# EAGLE design rk86_tft (EAGLE 7.7.0)

## Sheet 1 of 2
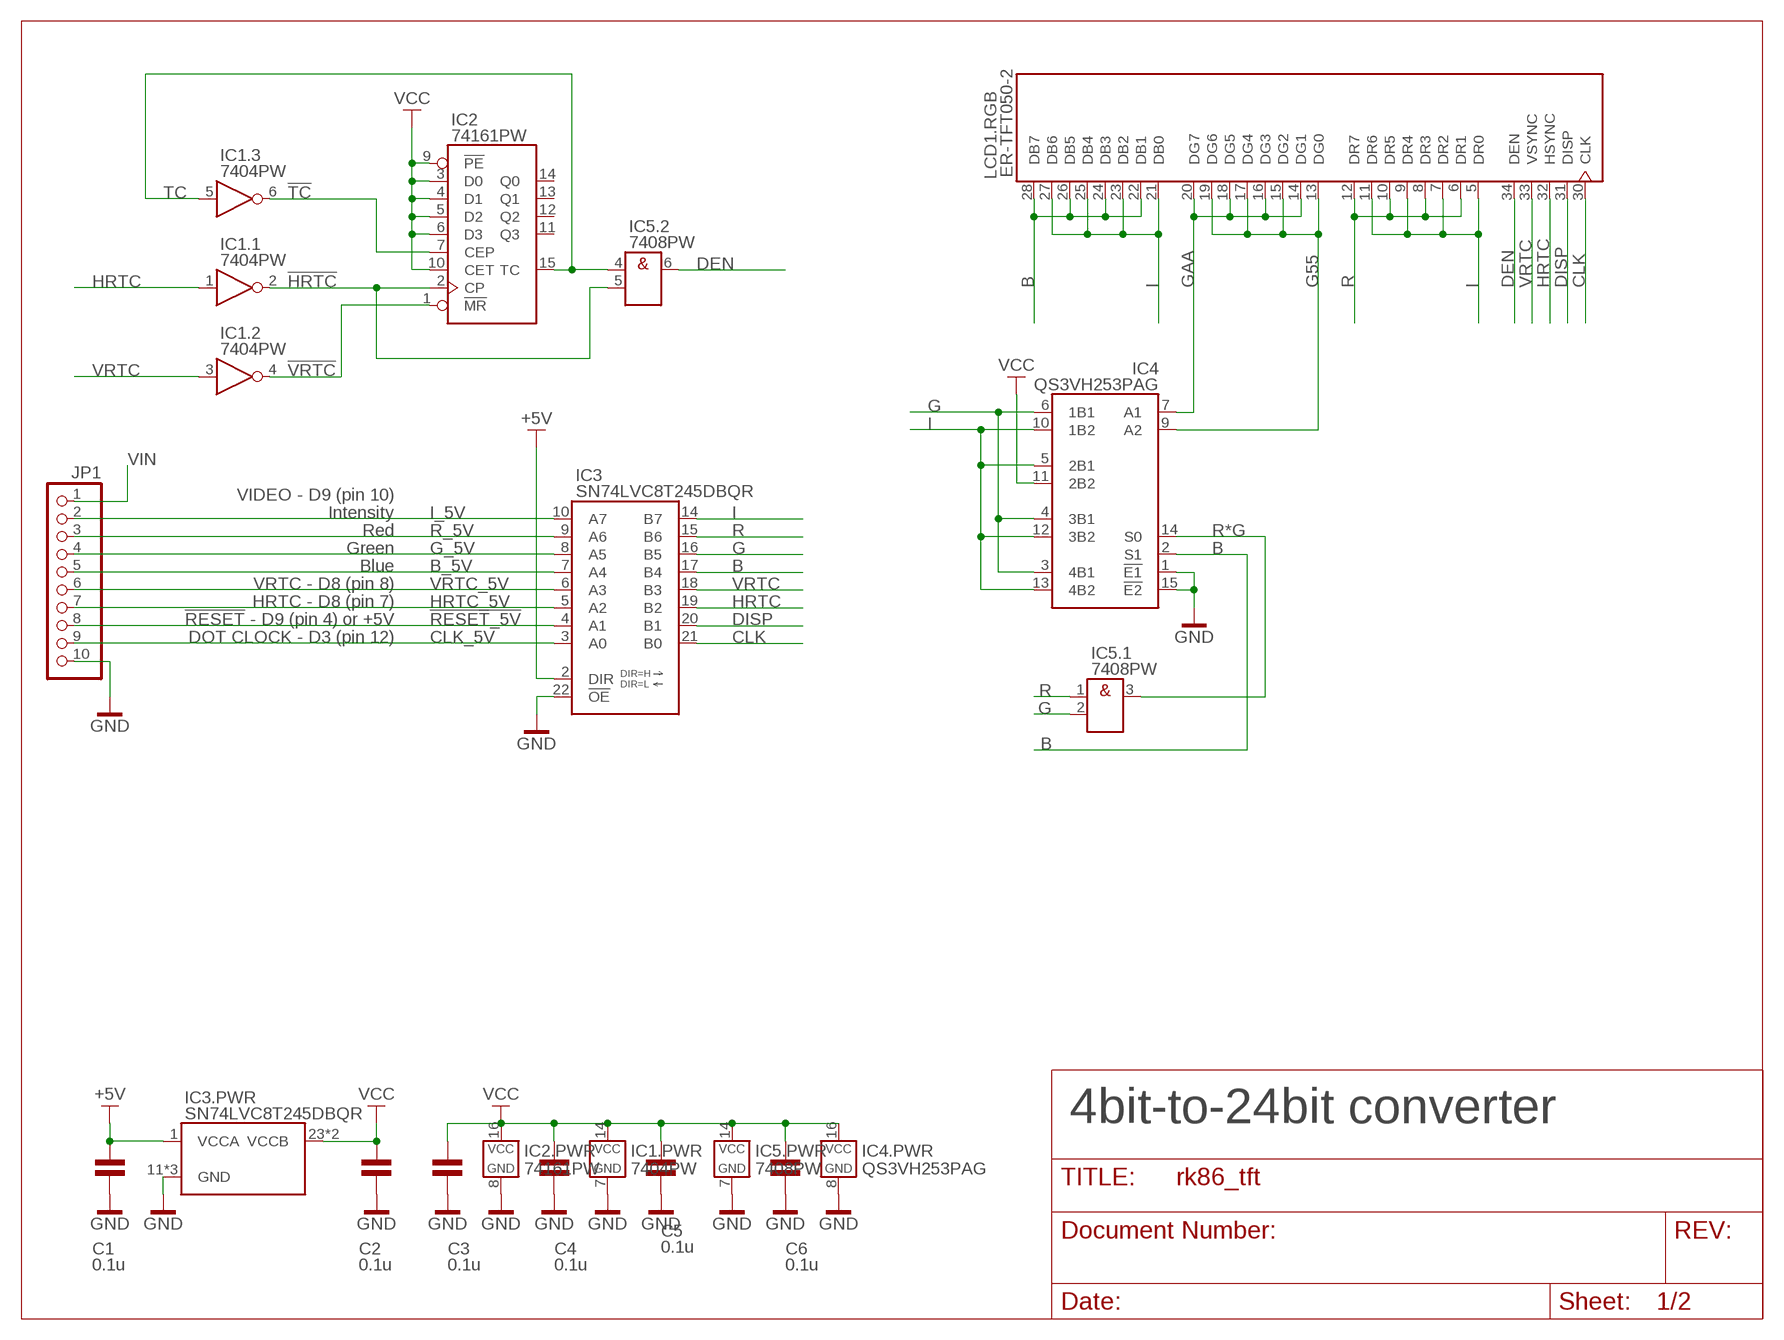
[diagram p0: schematic, sheet 1]

### Parts
C1  0.1u  CAPACITOR_SMD0805  [0805]
C2  0.1u  CAPACITOR_SMD0805  [0805]
C3  0.1u  CAPACITOR_SMD0805  [0805]
C4  0.1u  CAPACITOR_SMD0805  [0805]
C5  0.1u  CAPACITOR_SMD0805  [0805]
C6  0.1u  CAPACITOR_SMD0805  [0805]
IC1  7404PW  [TSSOP14_4.4]
IC2  74161PW  [TSSOP16_4.4]
IC3  SN74LVC8T245DBQR  [TI_DBQ24]
IC4  QS3VH253PAG  [TSSOP16_4.4]
IC5  7408PW  [TSSOP14_4.4]
JP1  PINHD-1X10/90  [1X10/90]
LCD1  ER-TFT050-2  [MOLEX_54104-4031]

### Nets
!HRTC: IC1.2(.1:Y) IC2.2(CP) IC5.5(.2:B) ; also sheet 2
!RESET_5V: IC3.4(A1) JP1.8
!TC: IC1.6(.3:Y) IC2.7(CEP)
!VRTC: IC1.4(.2:Y) IC2.1(!MR) ; also sheet 2
+5V [power]: C1.2 IC3.1(VCCA) IC3.2(DIR) ; also sheet 2
B: IC3.17(B4) IC4.2(S1) LCD1.22(.RGB:DB1) LCD1.24(.RGB:DB3) LCD1.26(.RGB:DB5) LCD1.28(.RGB:DB7)
B_5V: IC3.7(A4) JP1.5
CLK: IC3.21(B0) LCD1.30(.RGB:CLK) ; also sheet 2
CLK_5V: IC3.3(A0) JP1.9
DEN: IC5.6(.2:Y) LCD1.34(.RGB:DEN) ; also sheet 2
DISP: IC3.20(B1) LCD1.31(.RGB:DISP)
G: IC3.16(B5) IC4.3(4B1) IC4.4(3B1) IC4.6(1B1) IC5.2(.1:B)
G55: IC4.9(A2) LCD1.13(.RGB:DG0) LCD1.15(.RGB:DG2) LCD1.17(.RGB:DG4) LCD1.19(.RGB:DG6)
G_5V: IC3.8(A5) JP1.4
GAA: IC4.7(A1) LCD1.14(.RGB:DG1) LCD1.16(.RGB:DG3) LCD1.18(.RGB:DG5) LCD1.20(.RGB:DG7)
GND [power]: C1.1 C2.1 C3.1 C4.1 C5.1 C6.1 IC1.7(.PWR:GND) IC2.8(GND) IC3.11(GND) IC3.12(GND) IC3.13(GND) IC3.22(!OE) IC4.1(!E1) IC4.8(GND) IC4.15(!E2) IC5.7(.PWR:GND) JP1.10 ; also sheet 2
HRTC: IC1.1(.1:A) IC3.19(B2) LCD1.32(.RGB:HSYNC)
HRTC_5V: IC3.5(A2) JP1.7
I: IC3.14(B7) IC4.5(2B1) IC4.10(1B2) IC4.12(3B2) IC4.13(4B2) LCD1.5(.RGB:DR0) LCD1.7(.RGB:DR2) LCD1.9(.RGB:DR4) LCD1.11(.RGB:DR6) LCD1.21(.RGB:DB0) LCD1.23(.RGB:DB2) LCD1.25(.RGB:DB4) LCD1.27(.RGB:DB6)
I_5V: IC3.10(A7) JP1.2
R: IC3.15(B6) IC5.1(.1:A) LCD1.6(.RGB:DR1) LCD1.8(.RGB:DR3) LCD1.10(.RGB:DR5) LCD1.12(.RGB:DR7)
R*G: IC4.14(S0) IC5.3(.1:Y)
R_5V: IC3.9(A6) JP1.3
TC: IC1.5(.3:A) IC2.15(TC) IC5.4(.2:A)
VCC [power]: C2.2 C3.2 C4.2 C5.2 C6.2 IC1.14(.PWR:VCC) IC2.3(D0) IC2.4(D1) IC2.5(D2) IC2.6(D3) IC2.9(!PE) IC2.10(CET) IC2.16(VCC) IC3.23(VCCB) IC3.24(VCCB) IC4.11(2B2) IC4.16(VCC) IC5.14(.PWR:VCC) ; also sheet 2
VIN [power]: JP1.1 ; also sheet 2
VRTC: IC1.3(.2:A) IC3.18(B3) LCD1.33(.RGB:VSYNC)
VRTC_5V: IC3.6(A3) JP1.6
Unconnected: IC2.11(Q3) IC2.12(Q2) IC2.13(Q1) IC2.14(Q0)

### Notes on the sheet
- VIDEO - D9 (pin 10)
- Intensity
- Red
- Green
- Blue
- VRTC - D8 (pin 8)
- HRTC - D8 (pin 7)
- !RESET! - D9 (pin 4) or +5V
- DOT CLOCK - D3 (pin 12)
- 4bit-to-24bit converter

## Sheet 2 of 2
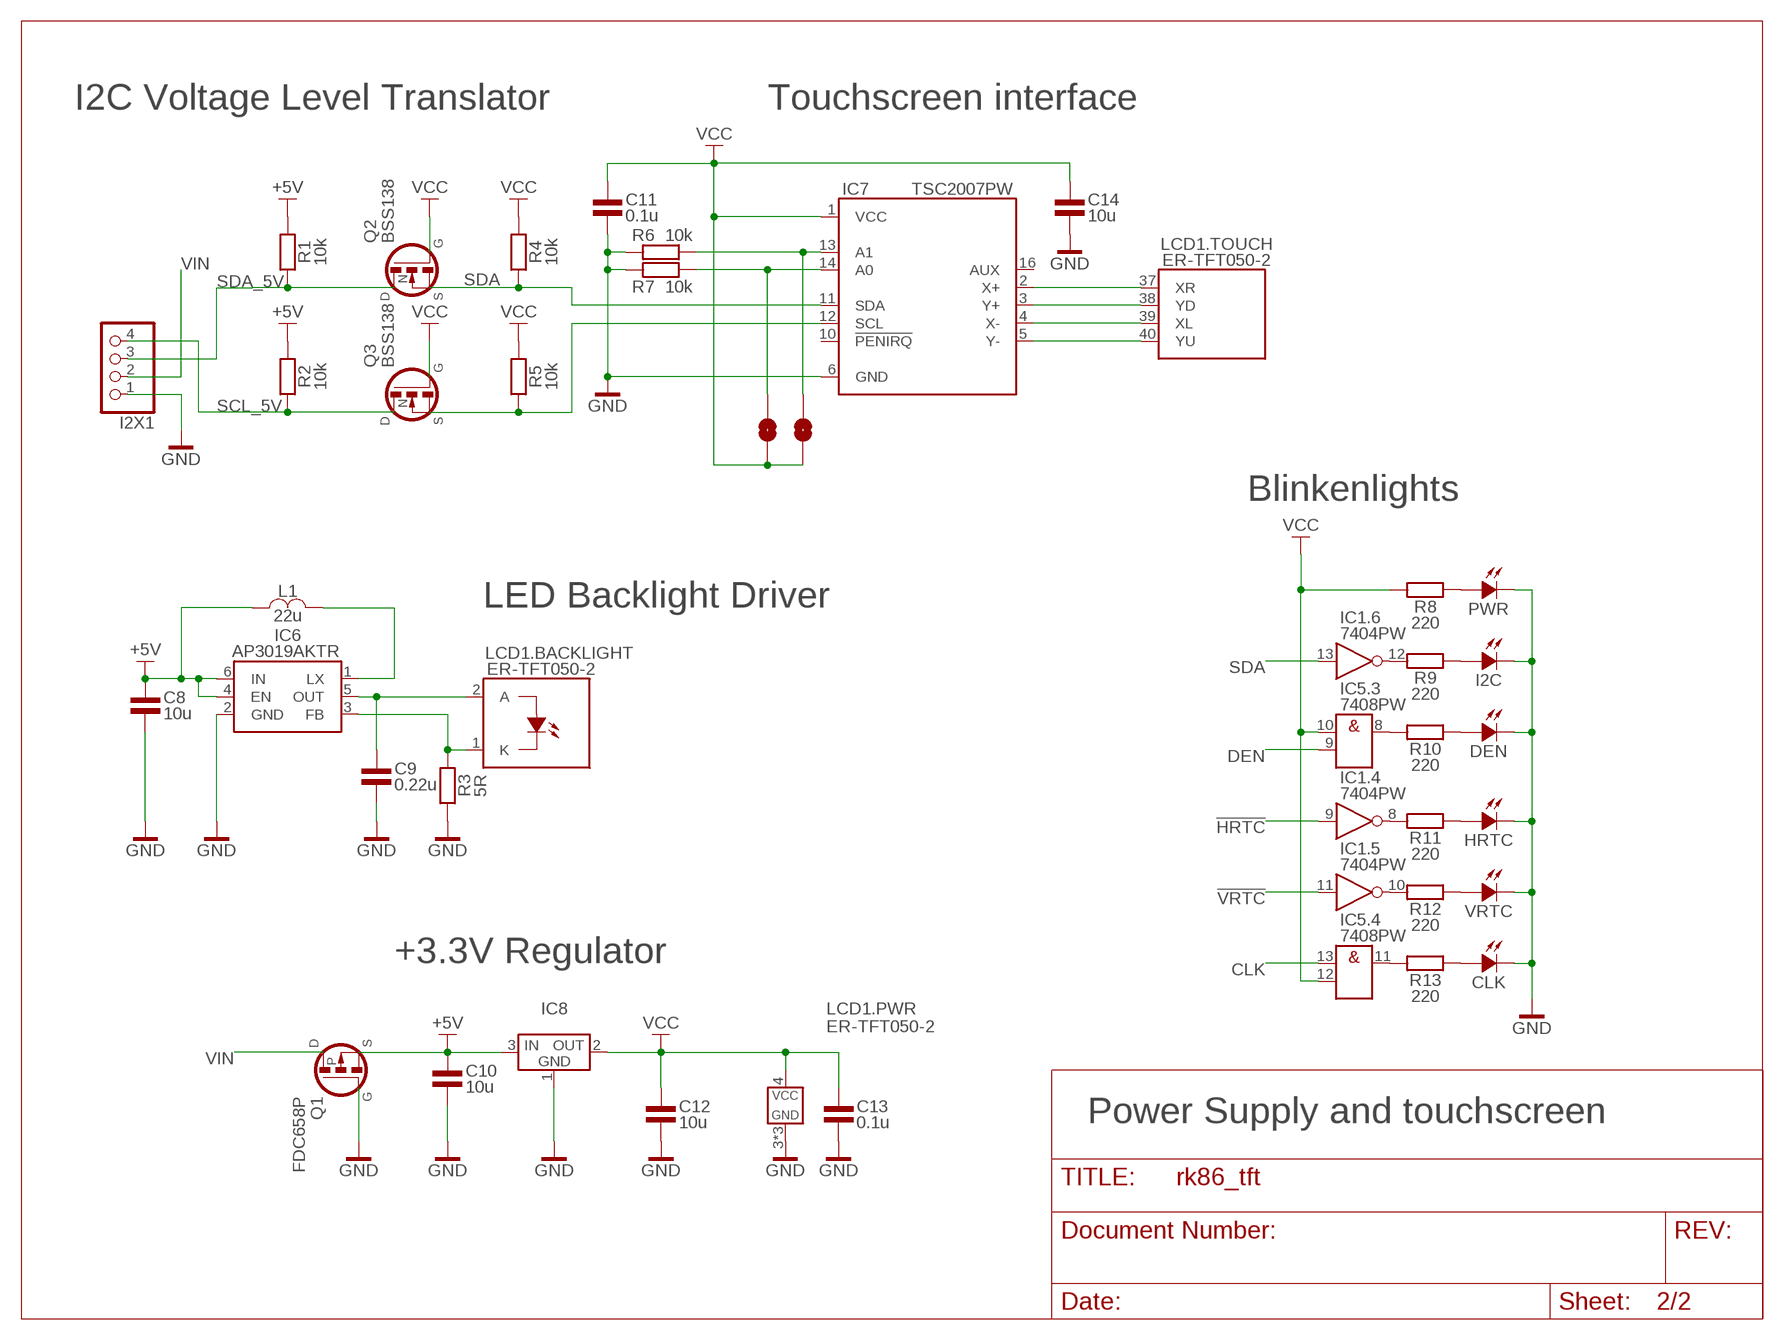
[diagram p1: schematic, sheet 2]

### Parts
A0  SJ  [SJ]
A1  SJ  [SJ]
C8  10u  CAPACITOR_SMD0805  [0805]
C9  0.22u  CAPACITOR_SMD0805  [0805]
C10  10u  CAPACITOR_SMD0805  [0805]
C11  0.1u  CAPACITOR_SMD0805  [0805]
C12  10u  CAPACITOR_SMD0805  [0805]
C13  0.1u  CAPACITOR_SMD0805  [0805]
C14  10u  CAPACITOR_SMD0805  [0805]
CLK  LED0805  [0805POL]
DEN  LED0805  [0805POL]
HRTC  LED0805  [0805POL]
I2C  LED0805  [0805POL]
I2X1  PINHD-1X4/90  [1X04/90]
IC6  AP3019AKTR  [SOT23-6]
IC7  TSC2007PW  [TSSOP16_4.4]
IC8  MCP1700TT  [SOT23-3]
L1  22u  INDUCTOR_FIXEDXTL7030  [COILCRAFT_XTL7030]
PWR  LED0805  [0805POL]
Q1  FDC658P  [SOT23-6]
Q2  BSS138  [SOT23-3]
Q3  BSS138  [SOT23-3]
R1  10k  RESISTOR0805  [0805]
R2  10k  RESISTOR0805  [0805]
R3  5R  RESISTOR0805  [0805]
R4  10k  RESISTOR0805  [0805]
R5  10k  RESISTOR0805  [0805]
R6  10k  RESISTOR0805  [0805]
R7  10k  RESISTOR0805  [0805]
R8  220  RESISTOR0805  [0805]
R9  220  RESISTOR0805  [0805]
R10  220  RESISTOR0805  [0805]
R11  220  RESISTOR0805  [0805]
R12  220  RESISTOR0805  [0805]
R13  220  RESISTOR0805  [0805]
VRTC  LED0805  [0805POL]

### Nets
!HRTC: IC1.9(.4:A) ; also sheet 1
!VRTC: IC1.11(.5:A) ; also sheet 1
+5V [power]: C8.2 C10.2 IC6.4(EN) IC6.6(IN) IC8.3(IN) L1.1 Q1.4(S) R1.2 R2.2 ; also sheet 1
CLK: IC5.13(.4:A) ; also sheet 1
DEN: IC5.9(.3:B) ; also sheet 1
GND [power]: C8.1 C9.1 C10.1 C11.1 C12.1 C13.1 C14.1 CLK.K DEN.K HRTC.K I2C.K I2X1.1 IC6.2(GND) IC7.6(GND) IC8.1(GND) LCD1.3(.PWR:GND) LCD1.29(.PWR:GND) LCD1.36(.PWR:GND) PWR.K Q1.3(G) R3.1 R6.1 R7.1 VRTC.K ; also sheet 1
LEDA [power]: C9.2 IC6.5(OUT) LCD1.2(.BACKLIGHT:A)
LEDK [power]: IC6.3(FB) LCD1.1(.BACKLIGHT:K) R3.2
LX [power]: IC6.1(LX) L1.2
N$1: IC1.8(.4:Y) R11.1
N$2: IC1.10(.5:Y) R12.1
N$3: IC1.12(.6:Y) R9.1
N$4: IC5.11(.4:Y) R13.1
N$5: IC5.8(.3:Y) R10.1
N$6: A1.2 IC7.13(A1) R6.2
N$7: A0.2 IC7.14(A0) R7.2
N$71: I2C.A R9.2
N$72: DEN.A R10.2
N$73: HRTC.A R11.2
N$74: R12.2 VRTC.A
N$77: IC7.2(X+) LCD1.37(.TOUCH:XR)
N$78: IC7.4(X-) LCD1.39(.TOUCH:XL)
N$79: IC7.3(Y+) LCD1.38(.TOUCH:YD)
N$80: IC7.5(Y-) LCD1.40(.TOUCH:YU)
N$90: CLK.A R13.2
N$91: PWR.A R8.2
SCL: IC7.12(SCL) Q3.2(S) R5.1
SCL_5V: I2X1.4 Q3.3(D) R2.1
SDA: IC1.13(.6:A) IC7.11(SDA) Q2.2(S) R4.1
SDA_5V: I2X1.3 Q2.3(D) R1.1
VCC [power]: A0.1 A1.1 C11.2 C12.2 C13.2 C14.2 IC5.10(.3:A) IC5.12(.4:B) IC7.1(VCC) IC8.2(OUT) LCD1.4(.PWR:VCC) Q2.1(G) Q3.1(G) R4.2 R5.2 R8.1 ; also sheet 1
VIN [power]: I2X1.2 Q1.1(D) Q1.2(D) Q1.5(D) Q1.6(D) ; also sheet 1
Unconnected: IC7.10(!PENIRQ) IC7.16(AUX)

### Notes on the sheet
- I2C Voltage Level Translator | Touchscreen interface
- Blinkenlights
- LED Backlight Driver
- +3.3V Regulator
- Power Supply and touchscreen

## Library data of the parts
A0 A1 = 1_eagle_lib:SJ: SMD solder JUMPER
C1-C6 C8-C14 = 1_eagle_lib:CAPACITOR_SMD
CLK DEN HRTC I2C PWR VRTC = 1_eagle_lib:LED: LED
I2X1 = pinhead:PINHD-1X4: PIN HEADER
IC1 = 1_eagle_lib:74*04: SNx4LVC04A Hex Inverters
IC2 = 1_eagle_lib:74*161: Presettable synchronous 4-bit binary counter; asynchronous reset
IC3 = 1_eagle_lib:SN74LVC8T245: SN74LVC8T245 8-Bit Dual-Supply Bus Transceiver With Configurable Voltage Translation and 3-State Outputs
IC4 = 1_eagle_lib:QS3VH253: QUICKSWITCH® PRODUCTS IDTQS3VH253 2.5V / 3.3V DUAL 4:1 MUX/DEMUX HIGH BANDWIDTH BUS SWITCH
IC5 = 1_eagle_lib:74*08: Quad 2-input AND gate
IC6 = 1_eagle_lib:AP3019A: The AP3019A is an inductor-based DC/DC converter designed to drive up to eight white LEDs in series for backlight. Only one feedback resistor is needed to control the LED current and obtain required brightness.
IC7 = 1_eagle_lib:TSC2007: TSC2007 Resisitive Touch Screen Controller
IC8 = 1_eagle_lib:MCP1700: Low Quiescent Current LDO
JP1 = pinhead:PINHD-1X10: PIN HEADER
L1 = 1_eagle_lib:INDUCTOR_FIXED: Bourns SRR4018 Series - Shielded SMD Power Inductors
LCD1 = 1_eagle_lib:ER-TFT050-2: ER-TFT050-2 5inch TFT display with RGB interface
Q1 = 1_eagle_lib:FDC658P: FDC658P Single P-Channel, Logic Level, PowerTrenchTM MOSFET
Q2 Q3 = 1_eagle_lib:BSS138: N-Channel Logic Level Enhancement Mode Field Effect Transistor
R1-R13 = 1_eagle_lib:RESISTOR: Vishay CMF Metal Film Resistors, Axial, Industrial, Precision

## Net classes
0 default: width 0.152 mm
1 power: width 0.254 mm

## Board
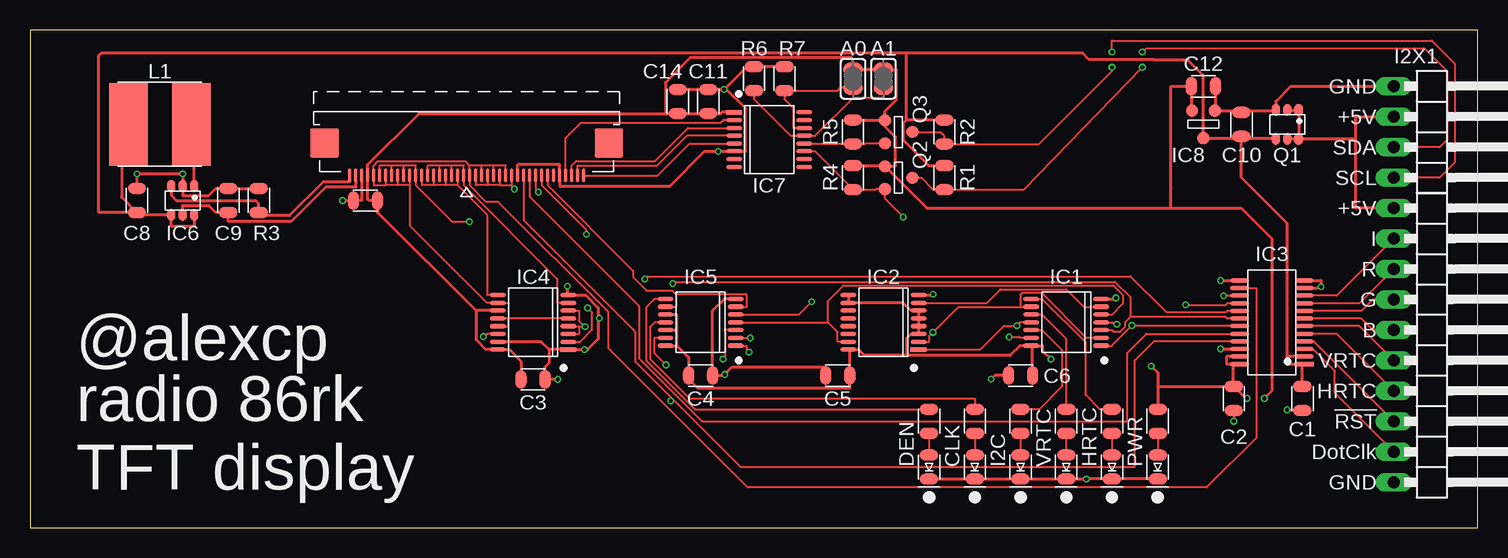
[diagram p2: board, top side]
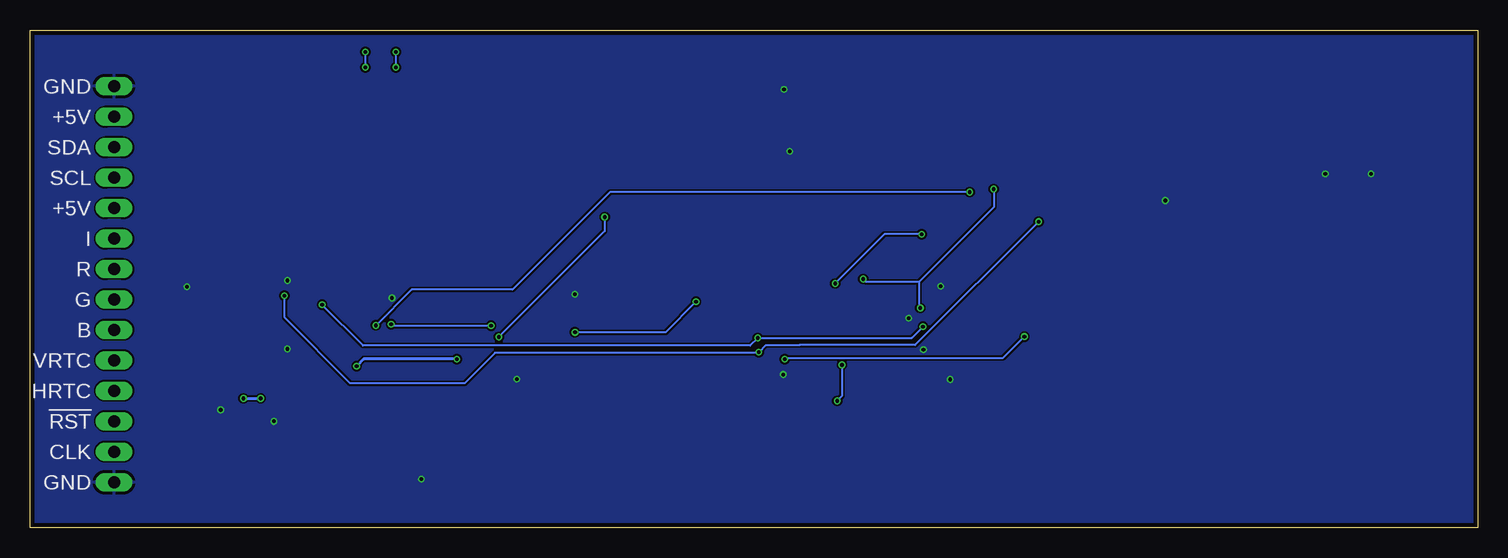
[diagram p3: board, bottom side, seen from below]

Size 120.7 x 41.53 mm. Coordinates in mm from the lower left corner, seen from the top.
Outline: 0,0 120.7,0 120.7,41.53 0,41.53 0,0
Copper layers (1*16): Top 0.035559375mm / dielectric 1.6mm / Bottom 0.035559375mm
Design rules "oshpark-2layer-tented": minimum track width 6mil, minimum drill 10mil, track to track 6mil, track to pad 6mil, pad to pad 6mil, via to via 6mil, smd to smd 6mil, copper to edge 15mil, drill to drill 6mil, minimum pad ring 5mil, minimum via ring 5mil, stop-mask expansion 2.5mil, vias tented up to drill 20mil, thermal gap 10mil

### Footprints (pad centres in the part's own frame; a part is rotated, then mirrored left to right if it is on the bottom)
SJ = smd 1.168 x 1.6: 1 -0.762,0; 2 0.762,0
0805 = smd 0.914 x 1.524: 1 -1.003,0; 2 1.003,0
0805POL = smd 0.914 x 1.524: A -1.003,0; K 1.003,0
1X04/90 = drill 1.016 long: 1 -3.81,-3.81; 2 -1.27,-3.81; 3 1.27,-3.81; 4 3.81,-3.81
TSSOP14_4.4 = smd 0.4 x 1.35: 1 -1.95,-2.925; 2 -1.3,-2.925; 3 -0.65,-2.925; 4 0,-2.925; 5 0.65,-2.925; 6 1.3,-2.925; 7 1.95,-2.925; 8 1.95,2.925; 9 1.3,2.925; 10 0.65,2.925; 11 0,2.925; 12 -0.65,2.925; 13 -1.3,2.925; 14 -1.95,2.925
TSSOP16_4.4 = smd 0.4 x 1.35: 1 -2.275,-2.925; 2 -1.625,-2.925; 3 -0.975,-2.925; 4 -0.325,-2.925; 5 0.325,-2.925; 6 0.975,-2.925; 7 1.625,-2.925; 8 2.275,-2.925; 9 2.275,2.925; 10 1.625,2.925; 11 0.975,2.925; 12 0.325,2.925; 13 -0.325,2.925; 14 -0.975,2.925; 15 -1.625,2.925; 16 -2.275,2.925
TI_DBQ24 = smd 0.4 x 1.6: 1 -3.493,-2.7; 2 -2.857,-2.7; 3 -2.223,-2.7; 4 -1.587,-2.7; 5 -0.953,-2.7; 6 -0.318,-2.7; 7 0.318,-2.7; 8 0.953,-2.7; 9 1.587,-2.7; 10 2.223,-2.7; 11 2.857,-2.7; 12 3.493,-2.7; 13 3.493,2.7; 14 2.857,2.7; 15 2.223,2.7; 16 1.587,2.7; 17 0.953,2.7; 18 0.318,2.7; 19 -0.318,2.7; 20 -0.953,2.7; 21 -1.587,2.7; 22 -2.223,2.7; 23 -2.857,2.7; 24 -3.493,2.7
SOT23-6 = smd 0.7 x 1: 1 -0.95,-1.2; 2 0,-1.2; 3 0.95,-1.2; 4 0.95,1.2; 5 0,1.2; 6 -0.95,1.2
SOT23-3 = smd 1.016 x 1.016: 1 -0.953,-1.143; 2 0.953,-1.143; 3 0,1.143
1X10/90 = drill 1.016 long: 1 -11.43,-3.81; 2 -8.89,-3.81; 3 -6.35,-3.81; 4 -3.81,-3.81; 5 -1.27,-3.81; 6 1.27,-3.81; 7 3.81,-3.81; 8 6.35,-3.81; 9 8.89,-3.81; 10 11.43,-3.81
COILCRAFT_XTL7030 = smd 3.2 x 6.85: 1 2.625,0; 2 -2.625,0
MOLEX_54104-4031 = smd 0.3 x 1.2: 1 9.75,0; 2 9.25,0; 3 8.75,0; 4 8.25,0; 5 7.75,0; 6 7.25,0; 7 6.75,0; 8 6.25,0; 9 5.75,0; 10 5.25,0; 11 4.75,0; 12 4.25,0; 13 3.75,0; 14 3.25,0; 15 2.75,0; 16 2.25,0; 17 1.75,0; 18 1.25,0; 19 0.75,0; 20 0.25,0; 21 -0.25,0; 22 -0.75,0; 23 -1.25,0; 24 -1.75,0; 25 -2.25,0; 26 -2.75,0; 27 -3.25,0; 28 -3.75,0; 29 -4.25,0; 30 -4.75,0; 31 -5.25,0; 32 -5.75,0; 33 -6.25,0; 34 -6.75,0; 35 -7.25,0; 36 -7.75,0; 37 -8.25,0; 38 -8.75,0; 39 -9.25,0; 40 -9.75,0 | smd 2.4 x 2.4: FIT1 11.85,-2.7; FIT2 -11.85,-2.7

### Placement (x,y rotation side)
A0  68.61,37.47 270 top
A1  71.15,37.47 270 top
C1  106.07,10.79 90 top
C2  100.36,10.79 90 top
C3  41.94,12.38 180 top
C4  55.91,12.7 180 top
C5  67.34,12.7 0 top
C6  82.58,12.7 0 top
C8  8.92,27.3 270 top
C9  16.54,27.3 270 top
C10  100.99,33.66 270 top
C11  56.54,35.56 270 top
C12  97.82,36.83 180 top
C13  27.97,27.3 0 top
C14  54,35.56 270 top
CLK  78.77,5.08 270 top
DEN  74.96,5.08 270 top
HRTC  90.2,5.08 270 top
I2C  82.58,5.08 270 top
I2X1  117.5,33.02 270 top
IC1  86.39,17.14 90 top
IC2  71.15,17.14 90 top
IC3  103.53,17.14 90 top
IC4  41.94,17.14 90 top
IC5  55.91,17.14 90 top
IC6  12.73,27.3 180 top
IC7  61.62,32.38 270 top
IC8  97.82,33.66 180 top
JP1  117.5,15.24 270 top
L1  10.82,33.66 180 top
LCD1  36.4,29.4 180 top
PWR  94.01,5.08 270 top
Q1  104.8,33.66 180 top
Q2  72.42,29.21 270 top
Q3  72.42,33.02 270 top
R1  76.23,29.21 90 top
R2  76.23,33.02 90 top
R3  19.08,27.3 270 top
R4  68.61,29.21 90 top
R5  68.61,33.02 90 top
R6  60.35,37.47 270 top
R7  62.89,37.47 270 top
R8  94.01,8.89 270 top
R9  82.58,8.89 270 top
R10  74.96,8.89 270 top
R11  90.2,8.89 270 top
R12  86.39,8.89 270 top
R13  78.77,8.89 270 top
VRTC  86.39,5.08 270 top

### Tracks (layer width: path | path; a pad name or v marks a point on that pad's centre or on a via)
!HRTC  (via drill 0.3)
  Top 0.152: 82.56,18.45 IC1.9 | IC1.2 88.08,15.85 84.33,19.59 82.7,19.59 82.56,19.44 82.56,18.45 | 82.56,18.45 77.41,18.45 v75.27,16.31 74.97,16.01 74.97,15.52 IC2.2 | IC5.5 64.1,17.8 v65.18,18.87
  Bottom 0.152: v65.18,18.87 67.74,16.31 v75.27,16.31
!RESET_5V
  Top 0.152: JP1.8 107.02,15.56 IC3.4
!TC
  Top 0.152: IC2.7 79.77,18.77 80.89,19.89 86.39,19.89 87.84,18.45 IC1.6
!VRTC  (via drill 0.3)
  Top 0.152: IC1.11 82.56,17.14 v82.27,16.85 81.19,16.85 79.21,14.87 IC2.1 | v90.6,16.98 90.38,16.98 90.21,17.14 IC1.4 | v90.6,16.98
  Bottom 0.152: v82.27,16.85 90.47,16.85 v90.6,16.98
+5V
  Top 0.254: 73.07,34.02 72.77,33.72 72.77,32.37 74.93,30.21 R1.2 | R2.2 73.07,34.02 | 73.07,34.02 73.07,39.63 | 73.07,39.63 87.71,39.63 88.29,39.05 93.69,39.05 96.49,39.05 97.81,37.73 IC8.3 101.62,32.51 | 101.62,32.51 103.85,32.51 Q1.4 | 101.62,32.51 101.62,32.65 C10.2 100.99,29.21 104.8,25.4 104.8,14.29 | 104.8,14.29 104.8,13.65 IC3.1 106.07,13.65 C1.2 | IC3.2 104.8,14.29 | C8.2 7.64,27.57 7.64,33.1 L1.1 | IC6.6 13.68,25.14 11.78,25.14 IC6.4 8.91,26.11 C8.2 | C8.2 5.74,26.3 5.74,39.37 6,39.63 73.07,39.63
B  (via drill 0.3)
  Top 0.152: IC3.17 99.8,18.1 99.7,17.99 94.73,17.99 91.74,20.98 51.48,20.98 v51.25,20.76 | IC4.2 45.84,15.52 46.87,16.55 46.87,17.95 v46.48,18.34 | 40.15,28.57 40.15,28.47 v40.36,28.26 | 39.15,28.57 40.15,28.57 | LCD1.22 37.15,28.57 38.15,28.57 | 39.15,28.57 38.15,28.57 | LCD1.24 38.15,28.57 | LCD1.28 40.15,28.57 | LCD1.26 39.15,28.57
  Bottom 0.152: 46.59,20.52 46.59,18.45 v46.48,18.34 | v40.36,28.26 40.36,26.75 46.59,20.52 | 46.59,20.52 51.02,20.52 v51.25,20.76
B_5V
  Top 0.152: JP1.5 111.94,16.51 110.98,17.46 IC3.7
CLK  (via drill 0.3)
  Top 0.152: 53.56,10.74 v53.41,10.6 | IC3.21 93.69,15.56 92.1,13.97 92.1,5.08 59.23,5.08 53.56,10.74 | LCD1.30 41.15,25.67 50.43,16.4 50.43,13.88 53.56,10.74 | v53.02,13.6 52.08,14.54 52.08,15.85 IC5.13
  Bottom 0.152: v53.02,13.6 53.02,10.99 v53.41,10.6
CLK_5V
  Top 0.152: JP1.9 108.79,11.25 108.79,13.08 106.94,14.92 IC3.3
DEN
  Top 0.152: IC5.6 59.73,18.45 59.73,19.44 59.65,19.52 53.98,19.52 53.88,19.43 | 53.88,19.43 53.88,18.45 IC5.9 | 53.88,19.43 53.52,19.8 51.39,19.8 50.28,20.91 50.28,21.44 43.15,28.57 LCD1.34
DISP
  Top 0.152: LCD1.31 41.65,27.61 50.77,18.49 50.77,14.15 56.03,8.89 91.47,8.89 91.47,14.61 93.05,16.19 IC3.20
G  (via drill 0.3)
  Top 0.152: IC4.6 45.76,18.12 45.76,17.27 v46.27,16.77 45.76,16.77 | IC4.4 45.76,16.82 45.76,16.77 | 45.76,16.77 45.76,16.17 IC4.3 | IC3.16 99.8,18.73 99.68,18.61 v96.34,18.61 | IC5.2 v60.03,15.85
  Bottom 0.152: v96.34,18.61 92.95,15.21 60.67,15.21 v60.03,15.85 47.19,15.85 v46.27,16.77
G55
  Top 0.152: LCD1.13 32.65,28.57 33.65,28.57 | 33.65,28.57 33.65,28.65 LCD1.15 | 34.65,28.57 33.65,28.57 | 35.65,28.57 34.65,28.57 | 35.65,28.57 35.65,28.65 LCD1.19 | 35.65,28.57 | 35.65,28.57 38.11,26.11 38.11,19.42 IC4.9 | LCD1.17 34.65,28.57
G_5V
  Top 0.152: JP1.4 111.94,19.05 110.98,18.1 IC3.8
GAA
  Top 0.152: IC4.7 43.96,18.77 43.96,20.77 36.15,28.57 LCD1.20 36.15,29.81 36.15,30.23 35.15,30.23 | LCD1.14 33.15,30.23 34.15,30.23 | 35.15,30.23 34.15,30.23 | LCD1.18 35.15,30.23 | LCD1.16 34.15,30.23
GND  (via drill 0.3)
  Top 0.254: C14.1 C11.1 v57.85,36.56 | IC5.7 57.88,19.09 56.91,18.13 C4.1 57.65,12.7 57.74,12.79 v57.9,12.79 58.54,13.42 66.29,13.42 66.29,12.74 C5.1 | IC3.11 107.31,20 107.41,20.1 v107.62,20.1 107.62,20.64 IC3.12 | IC8.1 98.82,34.8 | C12.1 98.82,34.8 | v75.29,19.49 75.1,19.49 75.03,19.42 IC2.8 | 47.37,17.5 47.37,15.76 46.49,14.87 v46.22,14.87 IC4.1 43.27,14.87 | 47.37,17.5 47.37,18.35 46.3,19.42 IC4.8 44.79,19.42 v44.79,20.16 | 47.37,17.5 v47.45,17.5 | R3.1 C9.1 15.49,28.31 14.91,27.73 12.72,27.73 IC6.2 v12.72,29.53 v8.91,29.53 C8.1 | C3.1 42.94,13.42 43.27,13.75 43.27,14.87 | LCD1.29 40.65,30.28 44.15,30.28 LCD1.36 44.15,28.52 53.34,28.52 56.23,31.41 IC7.6 59.65,31.41 59.65,34.99 58.08,36.56 v57.85,36.56 | IC1.7 90.27,19.09 90.35,19.18 v90.52,19.18 | R7.1 R6.1 59.76,38.47 v57.85,36.56 | 43.27,14.87 42.62,15.52 IC4.15 | C6.1 80.42,12.7 v80.11,12.39 | v99.24,20.64 IC3.13 | v99.24,14.92 IC3.22 | C2.1 v100.36,8.89 | 98.82,34.8 101.62,34.8 | 101.62,34.8 103.85,34.8 Q1.3 103.85,35.56 105.12,36.83 I2X1.1 | C10.1 101.62,34.66 101.62,34.8 | DEN.K CLK.K I2C.K VRTC.K v88.07,4.08 HRTC.K PWR.K | v104.8,9.84 106.07,9.84 C1.1 | v44,12.38 43.2,12.38 43.2,12.7 | LCD1.3 27.65,27.3 C13.1 v26.06,27.3
  other vias: 57.38,31.41
  pour Bottom: 0.15,41.4 120.55,41.4 120.55,0.13 0.15,0.13
HRTC  (via drill 0.3)
  Top 0.152: IC1.1 90.21,15.2 90.21,15.25 v91.86,16.89 99.74,16.89 99.8,16.83 IC3.19 | LCD1.32 42.15,28.23 v42.37,28.01
  Bottom 0.152: v42.37,28.01 72.35,28.01 80.49,19.87 88.87,19.87 v91.86,16.89
HRTC_5V
  Top 0.152: JP1.7 108.93,16.19 IC3.5
I
  Top 0.152: 36.65,30.23 36.34,30.53 28.95,30.53 28.65,30.23 LCD1.5 28.65,28.57 29.65,28.57 | 36.65,30.23 LCD1.21 36.65,28.57 38.04,27.18 39.04,27.18 48.21,18.01 48.21,14.97 59.81,3.37 98.08,3.37 102.26,7.55 102.26,20 IC3.14 | 37.65,30.23 36.65,30.23 | LCD1.23 37.65,30.23 | 38.65,30.23 37.65,30.23 | LCD1.25 38.65,30.23 | LCD1.27 39.65,30.23 38.65,30.23 | 30.65,28.57 29.65,28.57 | 31.65,28.57 30.65,28.57 | 31.65,28.57 31.65,25.23 38.11,18.77 IC4.10 39.91,18.77 39.91,17.47 | LCD1.9 30.65,28.57 | LCD1.7 29.65,28.57 | LCD1.11 31.65,28.57 | IC4.13 39.91,16.82 39.91,17.47 | IC4.5 39.91,17.47 | 39.91,17.47 IC4.12
I_5V
  Top 0.152: JP1.2 108.93,19.37 IC3.10
LEDA
  Top 0.254: IC6.5 12.72,26.88 14.91,26.88 15.49,26.3 C9.2 16.54,25.56 21.77,25.56 24.63,28.42 27.15,28.42 LCD1.2
LEDK
  Top 0.254: IC6.3 11.78,27.74 12.21,27.3 18.81,27.3 19.07,27.04 R3.2 19.07,26.04 21.61,26.04 24.47,28.89 26.65,28.89 LCD1.1
LX
  Top 0.254: IC6.1 13.68,33.42 L1.2
N$1
  Top 0.152: IC1.8 84.36,19.09 87.96,15.5 87.96,11.12 89.19,9.89 R11.1
N$2
  Top 0.152: IC1.10 84.36,17.8 86.39,15.77 R12.1
N$3
  Top 0.152: IC1.12 84.36,16.5 86.07,14.79 86.07,11.83 84.14,9.89 R9.1
N$4
  Top 0.152: IC5.11 52.08,17.14 51.75,16.82 51.75,14.04 54.99,10.79 78.77,10.79 R13.1
N$5
  Top 0.152: IC5.8 52.08,19.09 51.42,18.43 51.42,13.94 55.46,9.89 R10.1
N$6
  Top 0.152: A1.2 71.14,35.89 68.63,35.89 65.45,32.71 IC7.13 63.42,32.71 60.35,35.78 R6.2
N$7
  Top 0.152: A0.2 67.58,36.7 67.33,36.46 R7.2 62.89,35.78 63.64,35.02 63.64,33.36 IC7.14
N$71
  Top 0.152: R9.2 I2C.A
N$72
  Top 0.152: R10.2 DEN.A
N$73
  Top 0.152: R11.2 HRTC.A
N$74
  Top 0.152: VRTC.A R12.2
N$77
  Top 0.152: IC7.2 57.79,34.01 57.57,33.79 45.94,33.79 44.65,32.49 LCD1.37
N$78
  Top 0.152: LCD1.39 45.65,30.23 52.27,30.23 54.76,32.71 IC7.4
N$79
  Top 0.152: LCD1.38 45.15,30.23 45.53,30.61 52.09,30.61 54.84,33.36 IC7.3
N$80
  Top 0.152: LCD1.40 52.32,29.4 54.98,32.06 IC7.5
N$90
  Top 0.152: R13.2 CLK.A
N$91
  Top 0.152: R8.2 PWR.A
R  (via drill 0.3)
  Top 0.152: 31.15,30.23 30.23,30.23 30.15,30.15 | 31.15,30.23 31.15,30.15 LCD1.10 | 31.15,30.23 32.15,30.23 LCD1.12 32.15,29.06 32.15,28.57 35.18,25.54 v36.62,25.54 | LCD1.6 29.15,30.23 30.07,30.23 30.15,30.15 | LCD1.8 30.15,30.15 | IC5.1 59.73,15.2 59.73,14.86 v59.94,14.65 | v99.49,19.37 IC3.15
  Bottom 0.152: v99.49,19.37 99.49,17.55 94,12.06 84.48,12.06 81.94,14.61 59.98,14.61 v59.94,14.65 59.35,15.24 56.54,15.24 46.92,15.24 v36.62,25.54
R*G  (via drill 0.3)
  Top 0.152: v37.8,15.96 37.9,15.96 38.11,16.17 IC4.14 | v37.8,15.96 | IC5.3 57.93,16.5 57.93,14.23 v57.77,14.07
  Bottom 0.152: v57.77,14.07 57.67,14.18 39.58,14.18 v37.8,15.96
R_5V
  Top 0.152: JP1.3 110.83,18.73 IC3.9
SCL
  Top 0.152: IC7.12 65.45,32.06 65.49,32.02 R5.1 69.6,32.02 69.65,32.07 Q3.2
SCL_5V  (via drill 0.3)
  Top 0.152: Q3.3 75.91,33.02 76.22,32.7 R2.1 84.11,32.02 89.88,37.78 90.19,38.1 v90.19,38.42 | v90.19,39.69 90.19,40.64 116.86,40.64 118.77,38.73 118.77,30.48 117.5,29.21 I2X1.4
  Bottom 0.152: v90.19,38.42 v90.19,39.69
SDA  (via drill 0.3)
  Top 0.152: v72.8,25.92 71.27,27.45 Q2.2 70.54,28.26 70.48,28.21 69.6,28.21 R4.1 68.61,28.25 67.97,28.89 65.45,31.41 IC7.11 | IC1.13 82.56,15.85 82.48,15.93 v81.63,15.93
  Bottom 0.152: v72.8,25.92 72.8,24.75 v81.63,15.93
SDA_5V  (via drill 0.3)
  Top 0.152: Q2.3 74.3,29.21 75.23,28.27 75.23,28.21 R1.1 82.84,28.21 v92.73,38.42 | v92.73,39.69 93.05,40.01 116.23,40.01 118.14,38.1 118.14,32.38 117.5,31.75 I2X1.3
  Bottom 0.152: v92.73,38.42 v92.73,39.69
TC
  Top 0.152: 66.52,17.14 66.52,18.94 67.8,20.22 90.31,20.22 91.12,19.41 91.12,18.7 90.21,17.8 IC1.5 | IC2.15 67.32,15.52 67.32,16.35 66.52,17.14 | IC5.4 66.52,17.14
VCC  (via drill 0.3)
  Top 0.254: Q2.1 72.06,30.16 72.16,30.26 72.16,32.6 71.27,33.48 Q3.1 | Q3.1 71.27,34.76 72.22,35.71 72.22,38.23 A1.1 A0.1 68.61,39.09 68.49,39.2 55.02,39.2 52.96,37.15 52.96,34.56 | 100.29,11.8 C2.2 101.36,10.79 v101.47,10.79 | 100.29,13.65 99.75,13.65 99.75,14.29 IC3.23 | IC3.24 100.29,13.65 | 100.29,13.65 100.29,11.8 | 94,11.8 R8.1 | v93.47,13.48 94,12.95 94,11.8 | 94,11.8 100.29,11.8 | IC5.10 53.94,17.8 53.94,16.5 | IC5.12 53.94,16.5 | 53.94,15.2 | 53.94,15.2 53.94,16.5 | IC5.14 53.94,15.2 | 37.17,18.12 29.02,26.26 28.97,26.26 C13.2 28.23,27.3 28.15,27.39 LCD1.4 28.15,30.28 32.43,34.56 52.96,34.56 | IC4.11 37.17,18.12 | 37.17,18.12 37.17,15.7 37.99,14.87 IC4.16 39.97,14.87 40.93,13.9 C3.2 | 73.11,14.38 81.69,14.38 82.51,15.2 IC1.14 | 73.11,14.38 73.11,15.85 73.43,16.17 74.05,16.17 | 73.11,14.38 69.56,14.38 69.07,14.87 IC2.16 68.34,14.87 C5.2 68.34,11.65 55.69,11.65 54.9,12.43 C4.2 54.9,14.23 53.94,15.2 | 74.05,16.17 IC2.3 | 74.05,16.82 74.05,16.17 | Q3.1 69.7,33.97 69.65,34.02 R5.2 | 52.96,34.56 C14.2 C11.2 57.58,34.56 57.69,34.66 IC7.1 | R4.2 69.65,30.21 69.7,30.16 Q2.1 | IC1.14 84.42,15.2 84.42,14.77 v85.11,14.07 85.11,14.01 | IC2.5 74.05,17.47 | IC2.9 IC2.10 72.79,18.77 73.44,18.12 74.05,18.12 | 74.05,17.47 74.05,16.82 | IC2.4 74.05,16.82 | 74.05,18.12 74.05,17.47 | IC2.6 74.05,18.12 | IC8.2 96.86,35.74 96.81,35.79 C12.2 95.12,36.83 95.12,28.3 95.12,26.67 | Q2.1 74.77,26.67 95.12,26.67 | C6.2 83.58,15.08 IC1.14 | 95.12,26.67 100.99,26.67 103.53,24.13 103.53,11.43 v102.89,10.79
  Bottom 0.254: v85.11,14.07 92.88,14.07 v93.47,13.48 | v102.89,10.79 v101.47,10.79
VIN
  Top 0.254: Q1.2 Q1.1 Q1.6 | Q1.5 Q1.6 | I2X1.2 110.52,34.29 110.52,32.45 | Q1.6 110.52,32.45 | JP1.1 110.52,26.67 110.52,32.45
VRTC  (via drill 0.3)
  Top 0.152: LCD1.33 42.65,28.57 46.38,24.84 v46.38,24.49 | 91.72,17.58 91.27,17.13 91.27,16.78 90.83,16.34 90.37,16.34 90.21,16.5 IC1.3 | 91.72,17.58 99.68,17.58 99.8,17.46 IC3.18 | v53.58,20.38 53.72,20.52 90.46,20.52 91.72,19.26 91.72,17.58
  Bottom 0.152: v46.38,24.49 49.47,24.49 v53.58,20.38
VRTC_5V
  Top 0.152: JP1.6 110.83,16.83 IC3.6

### Text on the board
tPlace: GND | +5V | SDA | SCL | +5V | I | R | G | B | @alexcp | VRTC | HRTC | radio 86rk | !RST | DotClk | GND | TFT display
bPlace: GND | +5V | SDA | SCL | +5V | I | R | G | B | VRTC | HRTC | !RST | CLK | GND